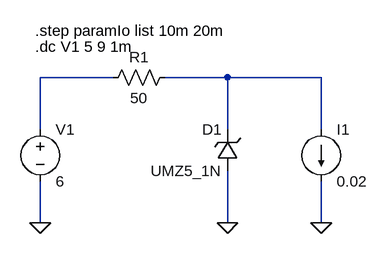
[diagram p0: schematic regulator_zener.asc]
regulator_zener.asc, the LTspice schematic file:
Version 4.1
SHEET 1 880 680
WIRE 80 96 -32 96
WIRE 256 96 160 96
WIRE 400 96 256 96
WIRE -32 176 -32 96
WIRE 256 176 256 96
WIRE 400 176 400 96
WIRE -32 320 -32 256
WIRE 256 320 256 240
WIRE 400 320 400 256
FLAG -32 320 0
FLAG 256 320 0
FLAG 400 320 0
SYMBOL res 176 80 R90
WINDOW 0 0 56 VBottom 2
WINDOW 3 32 56 VTop 2
SYMATTR InstName R1
SYMATTR Value 50
SYMBOL zener 272 240 R180
WINDOW 0 24 64 Left 2
WINDOW 3 24 0 Left 2
SYMATTR InstName D1
SYMATTR Value UMZ5_1N
SYMBOL voltage -32 160 R0
WINDOW 123 0 0 Left 0
WINDOW 39 0 0 Left 0
SYMATTR InstName V1
SYMATTR Value 6
SYMBOL current 400 176 R0
WINDOW 123 0 0 Left 0
WINDOW 39 0 0 Left 0
SYMATTR InstName I1
SYMATTR Value 0.02
TEXT -40 48 Left 2 !.dc V1 5 9 1m
TEXT -40 24 Left 2 !.step paramIo list 10m 20m

The netlist it stands for:
* regulator_zener.asc
R1 N002 N001 50
D1 0 N002 UMZ5_1N
V1 N001 0 6
I1 N002 0 0.02
.model D D
.lib standard.dio
.dc V1 5 9 1m
.step paramIo list 10m 20m
.backanno
.end